# Altium schematic sheet pmic.schdoc: PMIC
size A4; Date: 09.27.2026; CheckedBy: BCY; DrawnBy: miaow; Revision: v1.0.0; SheetNumber: 3; SheetTotal: 18; BoardType: MAIN_PCB; Desc: The AXP313A
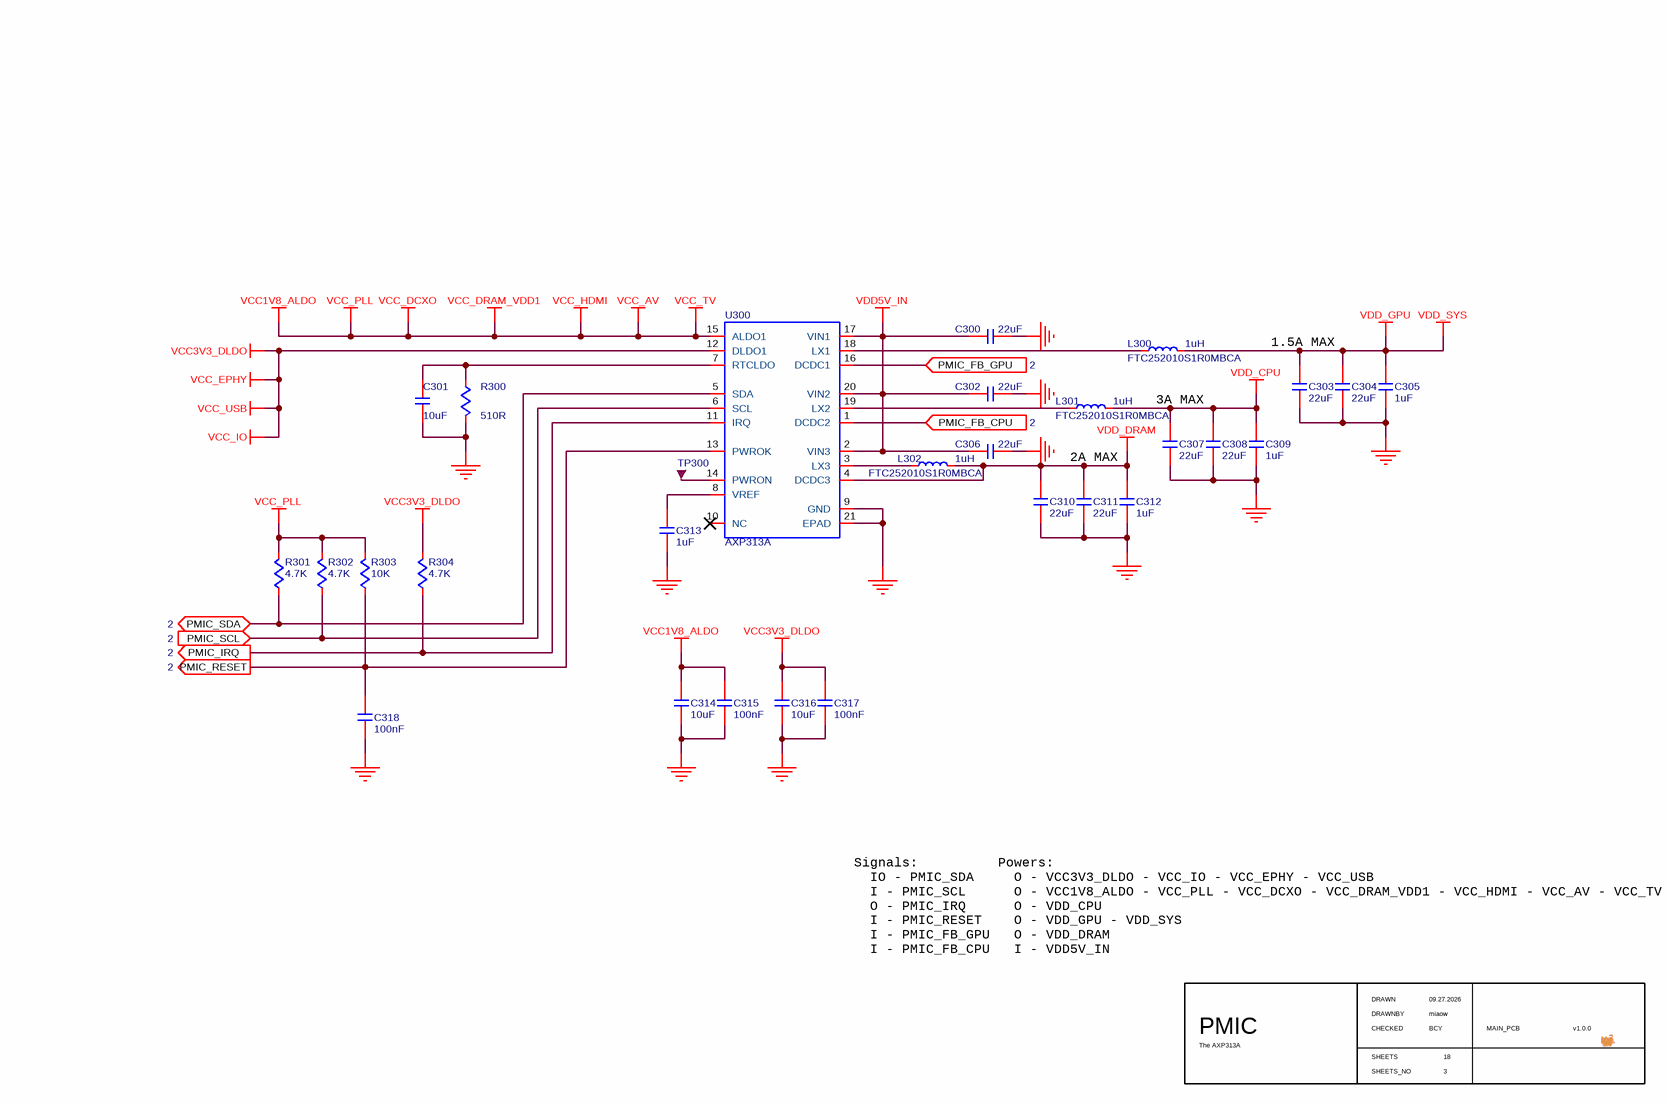
[diagram p0: pmic.schdoc]

## Parts
C300  value 22uF  [C0603]  (hidden comment: C-NOMO)
C301  value 10uF  [C0402]  (hidden comment: C-NOMO)
C302  value 22uF  [C0603]  (hidden comment: C-NOMO)
C303  value 22uF  [C0603]  (hidden comment: C-NOMO)
C304  value 22uF  [C0603]  (hidden comment: C-NOMO)
C305  value 1uF  [C0402]  (hidden comment: C-NOMO)
C306  value 22uF  [C0603]  (hidden comment: C-NOMO)
C307  value 22uF  [C0603]  (hidden comment: C-NOMO)
C308  value 22uF  [C0603]  (hidden comment: C-NOMO)
C309  value 1uF  [C0402]  (hidden comment: C-NOMO)
C310  value 22uF  [C0603]  (hidden comment: C-NOMO)
C311  value 22uF  [C0603]  (hidden comment: C-NOMO)
C312  value 1uF  [C0402]  (hidden comment: C-NOMO)
C313  value 1uF  [C0402]  (hidden comment: C-NOMO)
C314  value 10uF  [C0402]  (hidden comment: C-NOMO)
C315  value 100nF  [C0402]  (hidden comment: C-NOMO)
C316  value 10uF  [C0402]  (hidden comment: C-NOMO)
C317  value 100nF  [C0402]  (hidden comment: C-NOMO)
C318  value 100nF  [C0402]  (hidden comment: C-NOMO)
L300  FTC252010S1R0MBCA  value 1uH  [FTC252010]
L301  FTC252010S1R0MBCA  value 1uH  [FTC252010]
L302  FTC252010S1R0MBCA  value 1uH  [FTC252010]
R300  value 510R  [R0402]  (hidden comment: R)
R301  value 4.7K  [R0402]  (hidden comment: R)
R302  value 4.7K  [R0402]  (hidden comment: R)
R303  value 10K  [R0402]  (hidden comment: R)
R304  value 4.7K  [R0402]  (hidden comment: R)
TP300  TP  [TP]  (value not drawn)
U300  AXP313A  [AXP313A]

## Ports
PMIC_FB_CPU (in, see 2), PMIC_FB_GPU (in, see 2), PMIC_IRQ (out, see 2), PMIC_RESET (out, see 2), PMIC_SCL (in, see 2), PMIC_SDA (bidir, see 2)

## Nets
GND: C300.2 C301.2 C302.2 C303.1 C304.1 C305.1 C306.2 C307.1 C308.1 C309.1 C310.1 C311.1 C312.1 C313.2 C314.2 C315.2 C316.2 C317.2 C318.2 R300.1 U300.9(GND) U300.21(EPAD)
VCC1V8_ALDO: C314.1 C315.1 R301.1 R302.1 R303.1 U300.15(ALDO1)  [also labelled VCC_AV, VCC_DCXO, VCC_DRAM_VDD1, VCC_HDMI, VCC_PLL, VCC_TV]
VCC3V3_DLDO: C316.1 C317.1 R304.1 U300.12(DLDO1)  [also labelled VCC_EPHY, VCC_IO, VCC_USB]
VDD5V_IN: C300.1 C302.1 C306.1 U300.2(VIN3) U300.17(VIN1) U300.20(VIN2)
VDD_CPU: C307.2 C308.2 C309.2 L301.2
VDD_DRAM: C310.2 C311.2 C312.2 L302.2 U300.4(DCDC3)
VDD_GPU: C303.2 C304.2 C305.2 L300.2  [also labelled VDD_SYS]
PMIC_FB_CPU: U300.1(DCDC2) ; port PMIC_FB_CPU
PMIC_FB_GPU: U300.16(DCDC1) ; port PMIC_FB_GPU
PMIC_IRQ: R304.2 U300.11(IRQ) ; port PMIC_IRQ
PMIC_RESET: C318.1 R303.2 U300.13(PWROK) ; port PMIC_RESET
PMIC_SCL: R302.2 U300.6(SCL) ; port PMIC_SCL
PMIC_SDA: R301.2 U300.5(SDA) ; port PMIC_SDA
NetC301_1: C301.1 R300.2 U300.7(RTCLDO)
NetC313_1: C313.1 U300.8(VREF)
NetL300_1: L300.1 U300.18(LX1)
NetL301_1: L301.1 U300.19(LX2)
NetL302_1: L302.1 U300.3(LX3)
NetTP300_0: TP300.0 U300.14(PWRON)

Not connected (* = marked no-connect by the designer): U300 10(NC)*

## Notes on the sheet
- 3A MAX
- 1.5A MAX
- 2A MAX
- Signals:
  IO - PMIC_SDA
  I - PMIC_SCL
  O - PMIC_IRQ
  I - PMIC_RESET
  I - PMIC_FB_GPU
  I - PMIC_FB_CPU
- Powers:
  O - VCC3V3_DLDO - VCC_IO - VCC_EPHY - VCC_USB
  O - VCC1V8_ALDO - VCC_PLL - VCC_DCXO - VCC_DRAM_VDD1 - VCC_HDMI - VCC_AV - VCC_TV
  O - VDD_CPU
  O - VDD_GPU - VDD_SYS
  O - VDD_DRAM
  I - VDD5V_IN
- DRAWN
- CHECKED
- DRAWNBY
- SHEETS
- SHEETS_NO

## Library data of the parts
C300 C302-C304 C306-C308 C310 C311 = C-NOMO: voltage: 10V; precision: 20%; Supplier 1: LCSC; Supplier Part Number 1: C2980159
C301 C314 C316 = C-NOMO: voltage: 6.3V; precision: 20%; Supplier 1: LCSC; Supplier Part Number 1: C15525
C305 C309 C312 C313 = C-NOMO: voltage: 25V; precision: 10%; Supplier 1: LCSC; Supplier Part Number 1: C52923
C315 C317 C318 = C-NOMO: voltage: 50V; precision: 10%; Supplier 1: LCSC; Supplier Part Number 1: C307331
L300-L302 = L: Code_IEC: 1005; Published: 8-Jun-2000; LatestRevisionDate: 29-May-2009; LatestRevisionNote: IPC-7351 Footprint Added.; PackageReference: 0402-A; Publisher: Altium Limited; PackageDescription: Chip Inductor; Code_JEITA: 0402
R300-R304 = R: precision: 1%; Supplier 1: LCSC
  R300: Supplier Part Number 1: C25123
  R301 R302 R304: Supplier Part Number 1: C25900
  R303: Supplier Part Number 1: C25744
U300 = AXP313A: PMIC; Supplier 1: LCSC; Supplier Part Number 1: C5365290